# Altium schematic sheet Sheet1.SchDoc
size A4
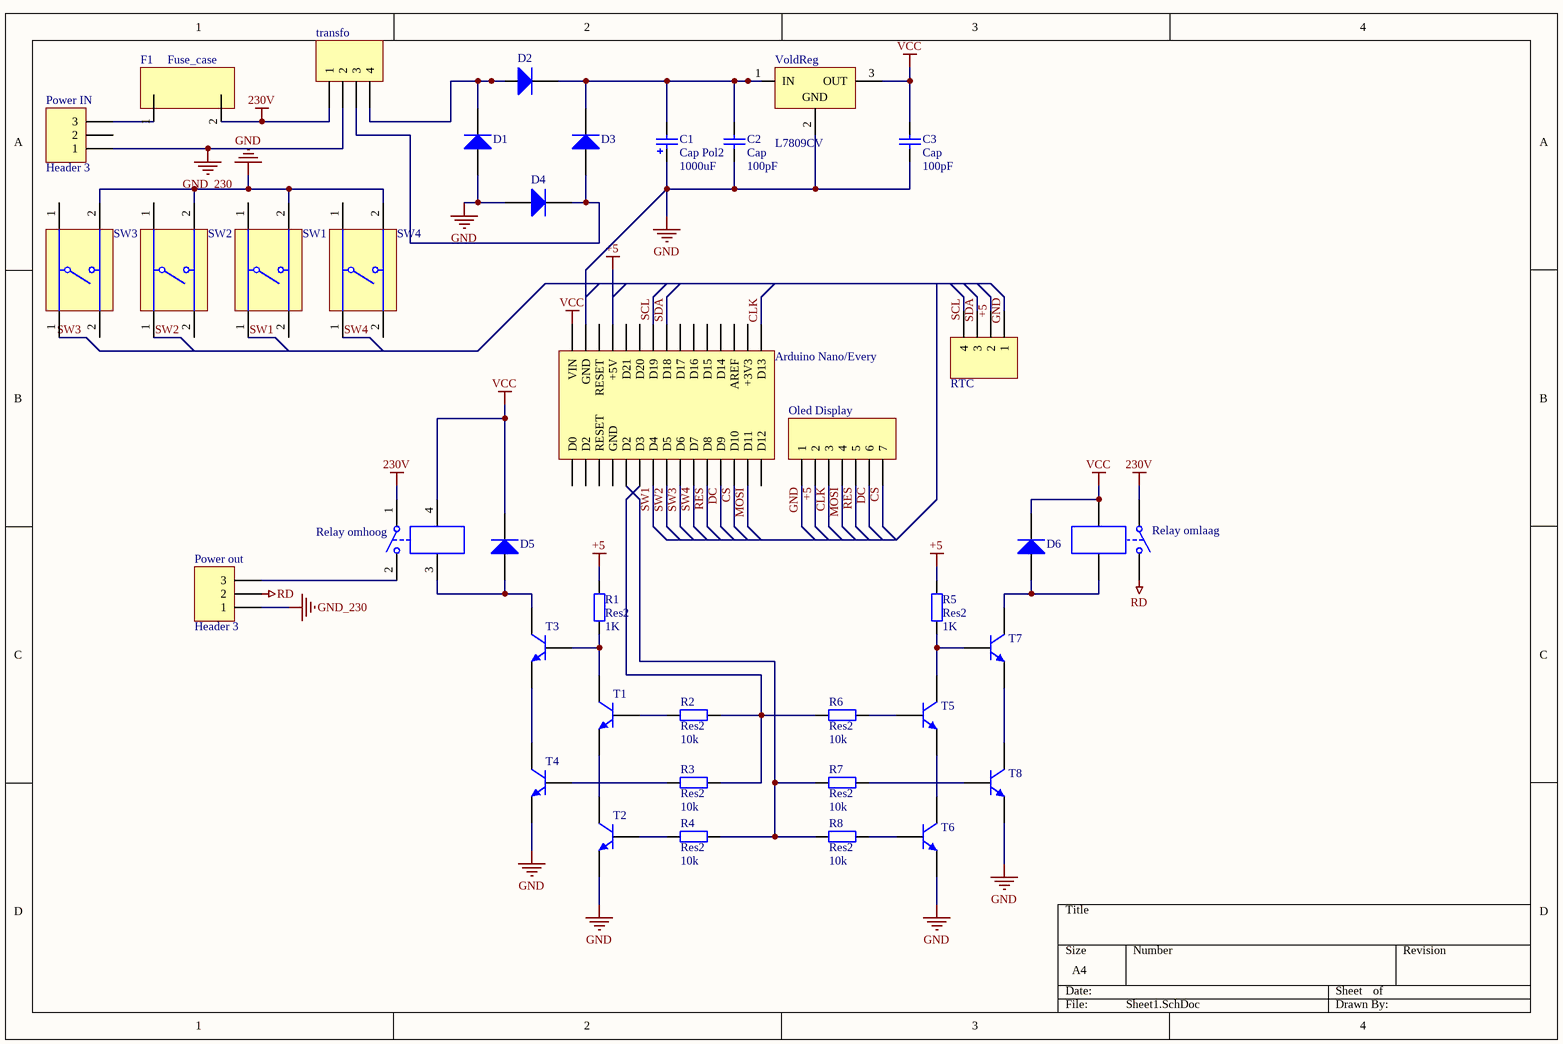
[diagram p0: Sheet1.SchDoc]

## Parts
Arduino_Nano/Every  Arduino Every  [Arduino Nano/Every - duplicate]  (value not drawn)
C1  Cap Pol2  value 1000uF  [capacitror 1000uF]
C2  Cap  value 100pF  [Capacitor 100pF]
C3  Cap  value 100pF  [Capacitor 100pF]
D1  Diode 1N4007  [DO-41]  (value not drawn)
D2  Diode 1N4007  [DO-41]  (value not drawn)
D3  Diode 1N4007  [DO-41]  (value not drawn)
D4  Diode 1N4007  [DO-41]  (value not drawn)
D5  Diode 1N4001  [DO-41]  (value not drawn)
D6  Diode 1N4001  [DO-41]  (value not drawn)
F1  Fuse_case  [fluse_holder]
Oled_Display  Header 7  [HDR1X7]  (value not drawn)
Power_IN  Header 3  [header_3]
Power_out  Header 3  [header_3]
R1  Res2  value 1K  [AXIAL-0.4]
R2  Res2  value 10k  [AXIAL-0.4]
R3  Res2  value 10k  [AXIAL-0.4]
R4  Res2  value 10k  [AXIAL-0.4]
R5  Res2  value 1K  [AXIAL-0.4]
R6  Res2  value 10k  [AXIAL-0.4]
R7  Res2  value 10k  [AXIAL-0.4]
R8  Res2  value 10k  [AXIAL-0.4]
Relay_omhoog  Relay-SPST  [print relay]  (value not drawn)
Relay_omlaag  Relay-SPST  [print relay]  (value not drawn)
RTC  Header 4  [HDR1X5]  (value not drawn)
SW1  PTS645SM43SMTR92LFS  [header_2]  (value not drawn)
SW2  PTS645SM43SMTR92LFS  [header_2]  (value not drawn)
SW3  PTS645SM43SMTR92LFS  [header_2]  (value not drawn)
SW4  PTS645SM43SMTR92LFS  [header_2]  (value not drawn)
T1  2N3904  [NPN]  (value not drawn)
T2  2N3904  [NPN]  (value not drawn)
T3  2N3904  [NPN]  (value not drawn)
T4  2N3904  [NPN]  (value not drawn)
T5  2N3904  [NPN]  (value not drawn)
T6  2N3904  [NPN]  (value not drawn)
T7  2N3904  [NPN]  (value not drawn)
T8  2N3904  [NPN]  (value not drawn)
transfo  Header 4  [Transfo]  (value not drawn)
VoldReg  L7809CV  [7809]

## Nets
230V: F1.2 Relay_omhoog.1 Relay_omlaag.1 transfo.1
+5: Arduino_Nano/Every.27(+5V) Oled_Display.2 R1.2 R5.2 RTC.2
GND: Arduino_Nano/Every.29(GND) C1.1 C2.1 C3.1 D1.1(A) D4.1(A) Oled_Display.1 RTC.1 SW1.2 SW2.2 SW3.2 SW4.2 T2.1(E) T4.1(E) T6.1(E) T8.1(E) VoldReg.2(GND)
GND_230: Power_IN.1 Power_out.1 transfo.2
RD: Power_out.2 Relay_omlaag.2
VCC: Arduino_Nano/Every.30(VIN) C3.2 D5.2(K) D6.2(K) Relay_omhoog.4 Relay_omlaag.3 VoldReg.3(OUT)
CLK: Arduino_Nano/Every.16(D13) Oled_Display.3
CS: Arduino_Nano/Every.13(D10) Oled_Display.7
DC: Arduino_Nano/Every.12(D9) Oled_Display.6
MOSI: Arduino_Nano/Every.14(D11) Oled_Display.4
RES: Arduino_Nano/Every.11(D8) Oled_Display.5
SCL: Arduino_Nano/Every.24(D19) RTC.4
SDA: Arduino_Nano/Every.23(D18) RTC.3
SW1: Arduino_Nano/Every.7(D4) SW1.1
SW2: Arduino_Nano/Every.8(D5) SW2.1
SW3: Arduino_Nano/Every.9(D6) SW3.1
SW4: Arduino_Nano/Every.10(D7) SW4.1
NetArduino_Nano/Every_5: Arduino_Nano/Every.5(D2) R4.2 R7.2 R8.2
NetArduino_Nano/Every_6: Arduino_Nano/Every.6(D3) R2.2 R3.2 R6.2
NetC1_2: C1.2 C2.2 D2.2(K) D3.2(K) VoldReg.1(IN)
NetD1_2: D1.2(K) D2.1(A) transfo.4
NetD3_1: D3.1(A) D4.2(K) transfo.3
NetD5_1: D5.1(A) Relay_omhoog.3 T3.3(C)
NetD6_1: D6.1(A) Relay_omlaag.4 T7.3(C)
NetF1_1: F1.1 Power_IN.3
NetPower_out_3: Power_out.3 Relay_omhoog.2
NetR1_1: R1.1 T1.3(C) T3.2(B)
NetR2_1: R2.1 T1.2(B)
NetR3_1: R3.1 T4.2(B)
NetR4_1: R4.1 T2.2(B)
NetR5_1: R5.1 T5.3(C) T7.2(B)
NetR6_1: R6.1 T5.2(B)
NetR7_1: R7.1 T8.2(B)
NetR8_1: R8.1 T6.2(B)
NetT1_1: T1.1(E) T2.3(C)
NetT3_1: T3.1(E) T4.3(C)
NetT5_1: T5.1(E) T6.3(C)
NetT7_1: T7.1(E) T8.3(C)

Not connected (* = marked no-connect by the designer): Arduino_Nano/Every 1(D0) 2(D2) 3(RESET) 4(GND) 15(D12) 17(+3V3) 18(AREF) 19(D14) 20(D15) 21(D16) 22(D17) 25(D20) 26(D21) 28(RESET); Power_IN 2

## Library data of the parts
C1 = Cap Pol2: Polarized Capacitor (Axial); Published: 8-Jun-2000; LatestRevisionDate: 17-Jul-2002; LatestRevisionNote: Re-released for DXP Platform.; PackageReference: POLAR0.8; Publisher: Altium Limited; PackageDescription: Polarized Capacitor; 2 Leads
C2 C3 = Cap: Capacitor; Published: 8-Jun-2000; LatestRevisionDate: 17-Jul-2002; LatestRevisionNote: Re-released for DXP Platform.; PackageReference: RAD-0.3; Publisher: Altium Limited; PackageDescription: Radial Cap, Thru-Hole; 2 Leads; 0.3 in Pin Spacing
D1-D4 = Diode 1N4007: 1 Amp General Purpose Rectifier; Published: 8-Jun-2000; LatestRevisionDate: 17-Jul-2002; LatestRevisionNote: Re-released for DXP Platform.; DatasheetVersion: 1998; PackageVersion: Aug-1999; PackageReference: DO-41; Publisher: Altium Limited; PackageDescription: Diode, Axial; Body 5.2 x 2.7 mm (LxDia. max), Lead Dia. 0.86 mm (max); Code_JEDEC: DO-204-AL; ComponentLink1Description: Manufacturer Link; ComponentLink1URL: http://www.fairchildsemi.com/; ComponentLink2Description: Datasheet; ComponentLink2URL: http://www.fairchildsemi.com/ds/1N%2F1N4001.pdf
D5 D6 = Diode 1N4001: 1 Amp General Purpose Rectifier; Published: 8-Jun-2000; LatestRevisionDate: 17-Jul-2002; LatestRevisionNote: Re-released for DXP Platform.; DatasheetVersion: 1998; PackageVersion: Aug-1999; PackageReference: DO-41; Publisher: Altium Limited; PackageDescription: Diode, Axial; Body 5.2 x 2.7 mm (LxDia. max), Lead Dia. 0.86 mm (max); Code_JEDEC: DO-204-AL; ComponentLink1Description: Manufacturer Link; ComponentLink1URL: http://www.fairchildsemi.com/; ComponentLink2Description: Datasheet; ComponentLink2URL: http://www.fairchildsemi.com/ds/1N%2F1N4001.pdf
Oled_Display = Header 7: Header, 7-Pin; LatestRevisionDate: 17-Jul-2002; LatestRevisionNote: Re-released for DXP Platform.; Publisher: Altium Limited
Power_IN Power_out = Header 3: Header, 3-Pin; LatestRevisionDate: 17-Jul-2002; LatestRevisionNote: Re-released for DXP Platform.; Publisher: Altium Limited
R1-R8 = Res2: Resistor; Published: 8-Jun-2000; LatestRevisionDate: 17-Jul-2002; LatestRevisionNote: Re-released for DXP Platform.; PackageReference: AXIAL-0.4; Publisher: Altium Limited; PackageDescription: Axial Device, Thru-Hole; 2 Leads; 0.4 in Pin Spacing
Relay_omhoog Relay_omlaag = Relay-SPST: Single-Pole Single-Throw Relay; Published: 24-Mar-1999; LatestRevisionDate: 17-Jul-2002; LatestRevisionNote: Re-released for DXP Platform.; PackageReference: MODULE4; Publisher: Altium Limited
RTC transfo = Header 4: Header, 4-Pin; LatestRevisionDate: 17-Jul-2002; LatestRevisionNote: Re-released for DXP Platform.; Publisher: Altium Limited
SW1-SW4 = knop: 6 mm Tact Switche, SPST, NO, -20 to 60 degC, 4-Pin SMT, RoHS, Tape and Reel; Manufacturer: ITT Cannon; Manufacturer URL: http://www.ittcannon.com/; Datasheet Version: Feb-14; Datasheet URL: https://datasheet.ciiva.com/29903/getdatasheetpartid-786341-29903846.pdf
T1-T8 = 2N3904: NPN General Purpose Amplifier; Published: 8-Jun-2000; LatestRevisionDate: 15-Jan-2003; LatestRevisionNote: PCB Footprint 'BCY-W3/D4.7' replaced; DatasheetVersion: 1997; PackageVersion: Sep-1998; PackageReference: TO-92A; Publisher: Altium Limited; PackageDescription: TO, Flat Index; 3 In-Line, Axial Leads; Body Dia. 4.5mm; Leads 0.51 x 0.48 mm (max); ComponentLink1Description: Manufacturer Link; ComponentLink1URL: http://www.fairchildsemi.com/; ComponentLink2Description: Datasheet; ComponentLink2URL: http://www.fairchildsemi.com/ds/2N%2F2N3904.pdf
VoldReg = V-reg 7809: Positive Voltage Regulator, 9V, 3-Pin TO-220; ComponentLink3URL: http://www.st.com/internet/com/TECHNICAL_RESOURCES/TECHNICAL_LITERATURE/PACKAGE_INFORMATION/CD00004649.pdf; ComponentLink2Description: Datasheet; DatasheetVersion: 16/11/2011; PackageVersion: ver3.0; PackageDescription: TO, Thru-Hole, Vertical, Heatsink Mounted; 3 In-Line Leads; Pitch 2.54 mm; ComponentLink3Description: Package Specification; ComponentLink2URL: http://www.st.com/internet/com/TECHNICAL_RESOURCES/TECHNICAL_LITERATURE/DATASHEET/CD00000444.pdf; ComponentLink1URL: http://www.st.com; ComponentLink1Description: Manufacturer URL; PackageReference: TO220